# EAGLE design BIRDS-5_FM_+Z Panel_Ver2 (EAGLE 9.6.2)
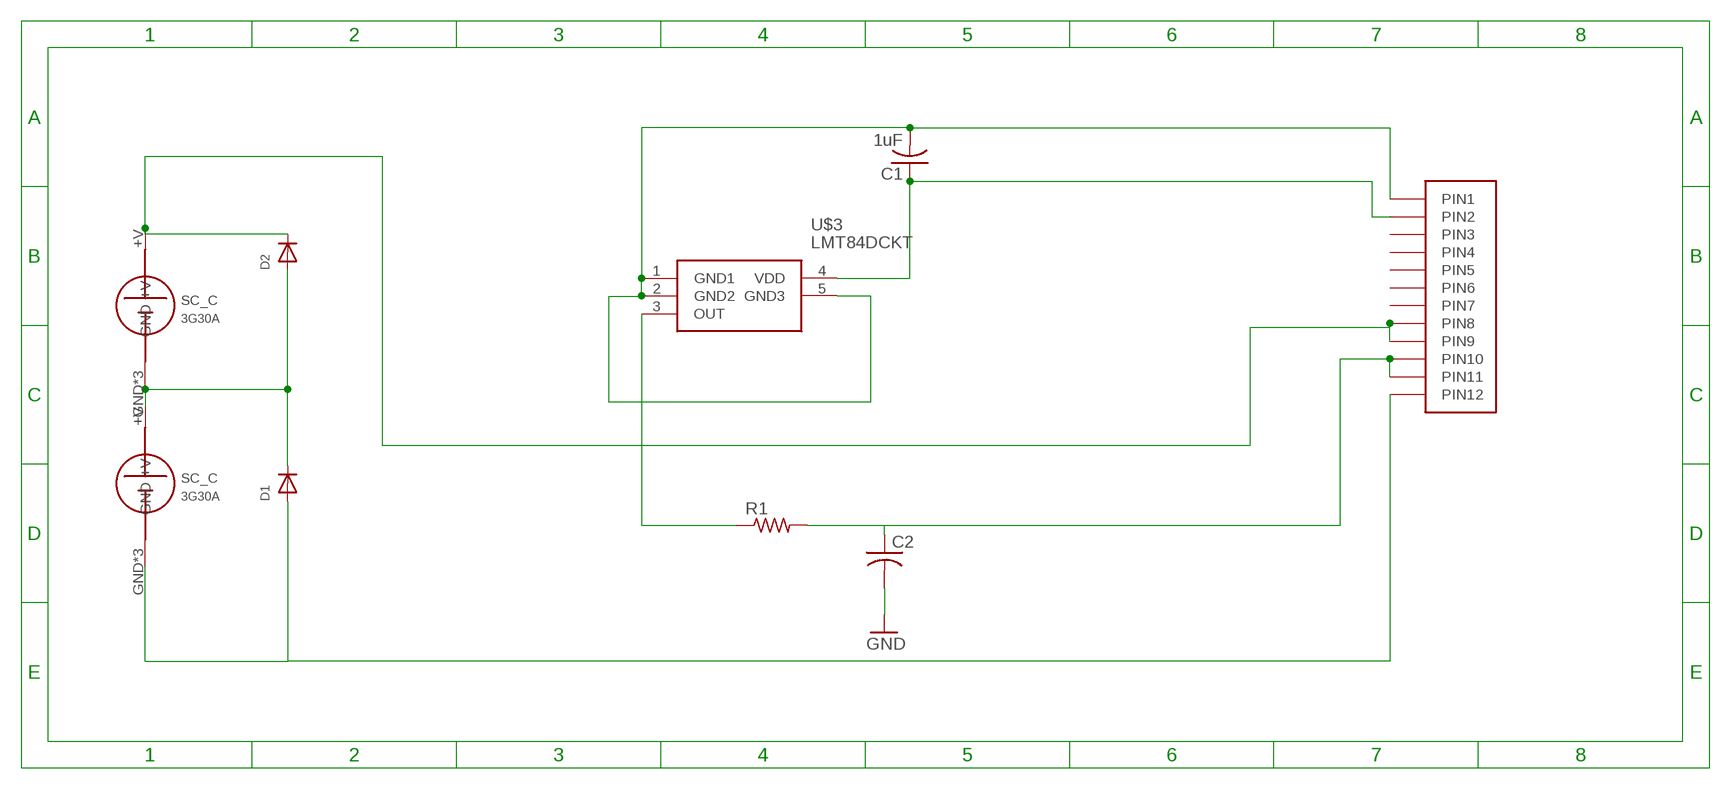
[diagram p0: schematic, sheet 1]

## Parts
C1  1uF  C-USC2012  [C2012]
C2  C-USC2012  [C2012]
D1  DIODE_SOD-123FL  [SOD-123FL]
D2  DIODE_SOD-123FL  [SOD-123FL]
R1  R-US_R0402  [R0402]
U$1  HEADER12PIN  [HEADER12PIN]
U$3  LMT84DCKT  [SOT65P210X110-5N]
U$4  SC_C  [SC_C]
U$5  SC_C  [SC_C]

## Nets
+V: D2.C U$1.P8(PIN8) U$1.P9(PIN9) U$4.+V
+VB: D1.C D2.A U$4.GND U$4.GND1(GND) U$4.GND2(GND) U$5.+V
GND: C1.2 C2.2 D1.A U$1.P1(PIN1) U$1.P12(PIN12) U$3.1(GND1) U$3.2(GND2) U$3.5(GND3) U$5.GND U$5.GND1(GND) U$5.GND2(GND)
N$3: C1.1 U$1.P2(PIN2) U$3.4(VDD)
N$5: R1.1 U$3.3(OUT)
N$6: C2.1 R1.2 U$1.P10(PIN10) U$1.P11(PIN11)
Unconnected: U$1.P3(PIN3) U$1.P4(PIN4) U$1.P5(PIN5) U$1.P6(PIN6) U$1.P7(PIN7)

## Library data of the parts
C1 C2 = adafruit:C-US: CAPACITOR, American symbol
D1 D2 = adafruit:DIODE: Diode SMADIODE - SMA Surface Mount Package 20V 1A Schottky Diode Digikey: 641-1014-6-ND DO-1N4148 - Through Hole Small Current Diode SOD-123 20V 1 A (.5mV Vf) Schottky Diode - Digikey: MBRX120TPMSCT-ND SOD-323 10V 570mA (.38mV Vf, 3ns) Schottky Diode - Digikey: ZLLS410CT-ND SOD-523 30V 30mA Schottky Diode (RB751S-40TE61) - Digikey: RB751S-40TE61CT-ND SOT23-R/W - SOT23 Package (R = Solder Paste/Reflow Ovens, W = Hand-Soldering) BAT54Film 40V 300mA - Digikey: 497-7162-1-ND
R1 = adafruit:R-US_: RESISTOR, American symbol
U$1 = BIRDS:HEADER12PIN
U$3 = LMT84DCKT:LMT84DCKT: 1.5V-Capable, 10 uA Analog Output Temperature Sensor in SC70 and TO-92 Source: Datasheet <http://uk.rs-online.com/web/p/products/8115860>; DESCRIPTION: 1.5V-Capable, 10 uA Analog Output Temperature Sensor in SC70 and TO-92; HEIGHT: 1.1mm; MANUFACTURER_NAME: Texas Instruments; MANUFACTURER_PART_NUMBER: LMT84DCKT; RS_PART_NUMBER: 8115860
U$4 U$5 = SC_C:SC_C

## Board
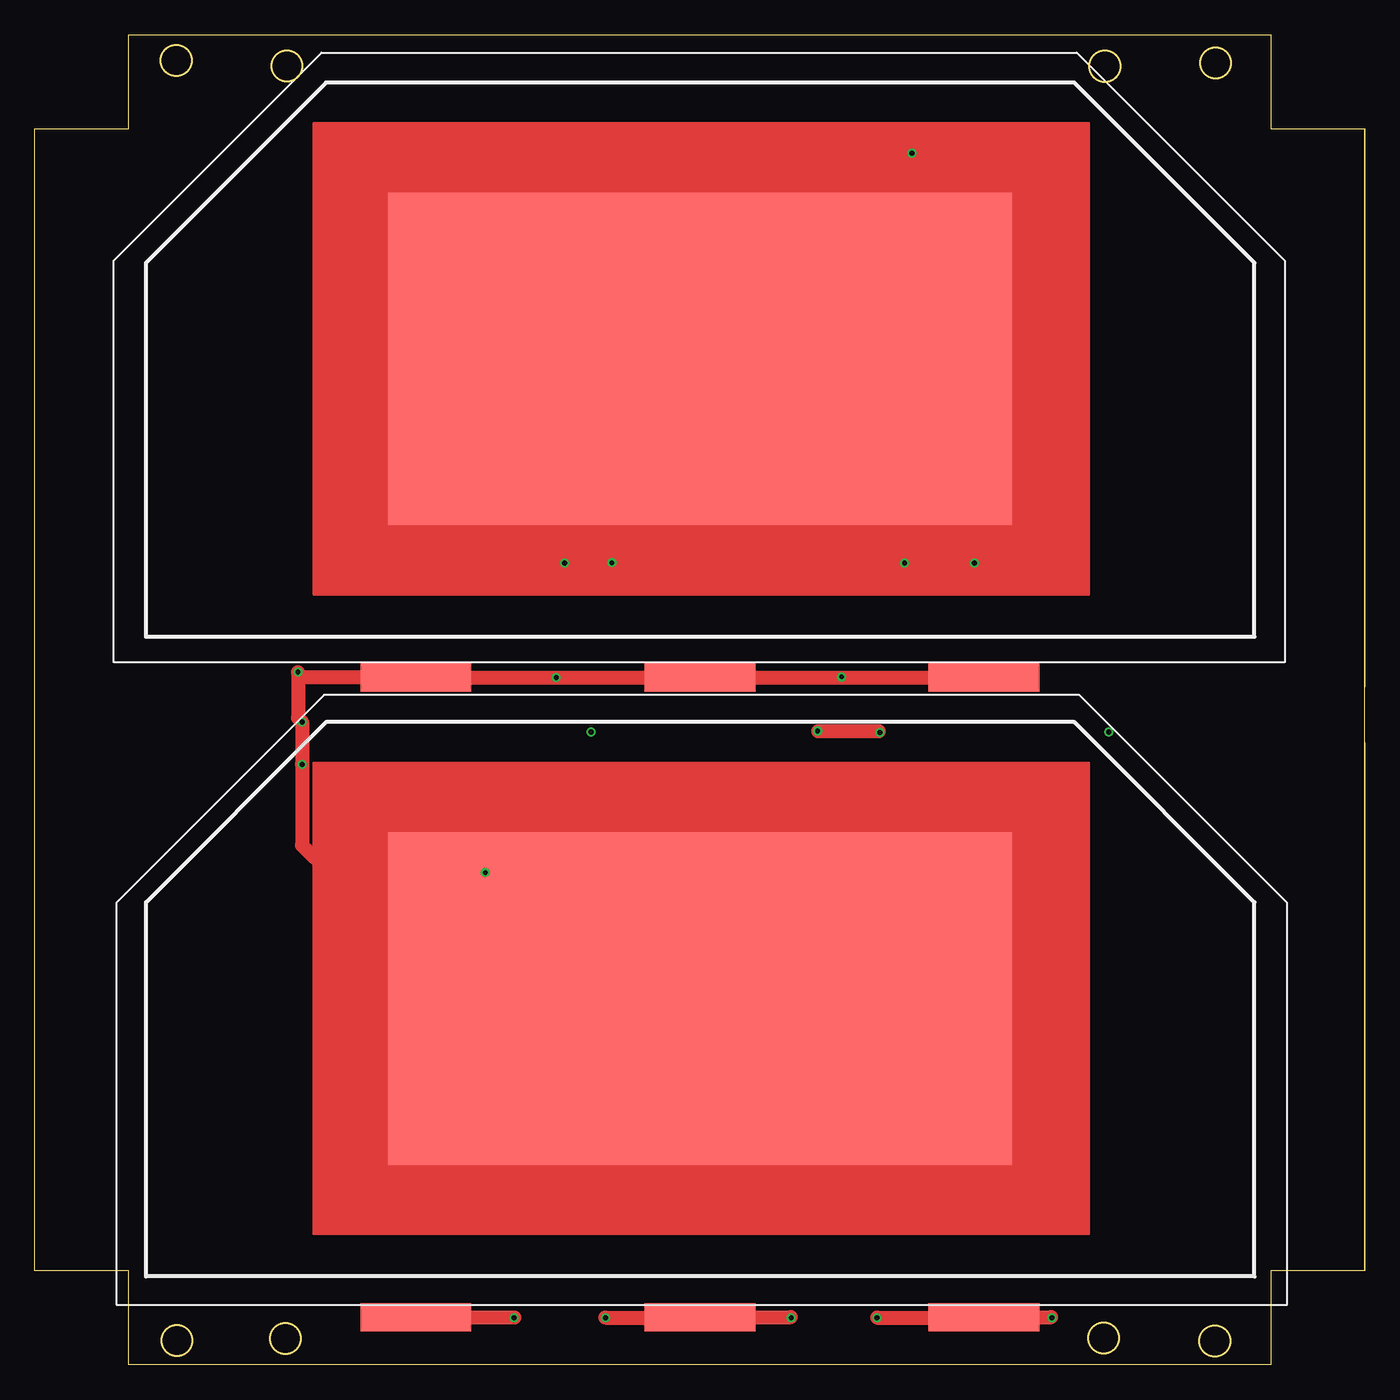
[diagram p1: board, top side]
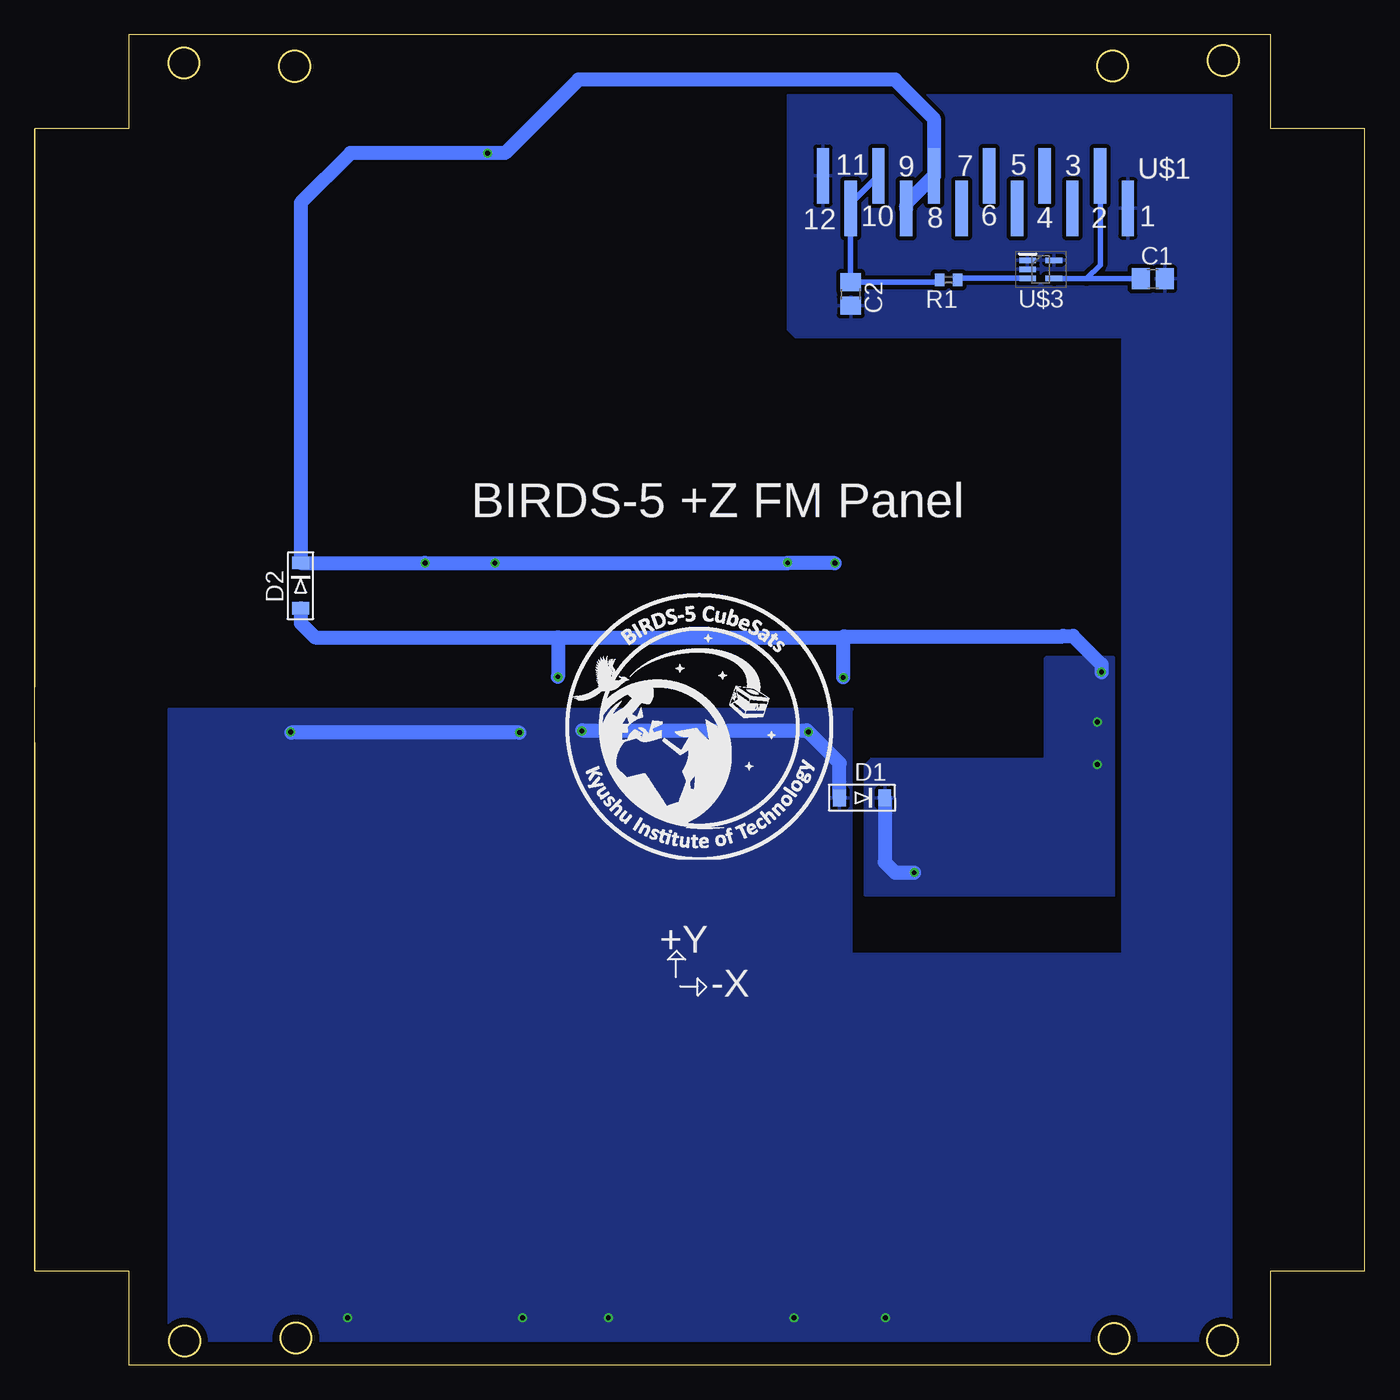
[diagram p2: board, bottom side, seen from below]

Size 96 x 96 mm. Coordinates in mm from the lower left corner, seen from the top.
Outline: 96,6.8 96,89.2
Outline: 96,89.2 96,48.91
Outline: 96,89.2 89.2,89.2 89.2,96 6.8,96 6.8,89.2 0,89.2 0,48.91 0,44.91 0,6.8 6.8,6.8 6.8,0 89.2,0 89.2,6.8 96,6.8
Outline: 96,44.91 96,6.8
Outline: circle at 77.23,93.72 radius 1.1
Outline: circle at 77.14,1.94 radius 1.1
Outline: circle at 18.22,93.75 radius 1.1
Outline: circle at 18.09,1.9 radius 1.1
Outline: circle at 10.26,1.74 radius 1.1
Outline: circle at 10.21,94.13 radius 1.1
Outline: circle at 85.22,93.96 radius 1.1
Outline: circle at 85.17,1.71 radius 1.1
Copper layers (1*16): Top 0.035mm / dielectric 1.53mm / Bottom 0.035mm
Design rules "pban_5mil-l2 *": minimum track width 5mil, minimum drill 0.3mm, track to track 5mil, track to pad 0.229mm, pad to pad 5mil, via to via 5mil, smd to smd 5mil, copper to edge 0.5mm, drill to drill 0.5mm, minimum pad ring 0.15mm, minimum via ring 0.15mm, stop-mask expansion 0.05mm, vias tented up to drill 0.35mm, thermal gap 10mil

### Footprints (pad centres in the part's own frame; a part is rotated, then mirrored left to right if it is on the bottom)
C2012 = smd 1.3 x 1.5: 1 -0.85,0; 2 0.85,0
SOD-123FL = smd 0.91 x 1.22 bottom: A 1.637,0; C -1.637,0
R0402 = smd 0.7 x 0.9: 1 -0.65,0; 2 0.65,0
HEADER12PIN = smd 4 x 0.89: P1 0,0; P2 2.35,2; P3 0,4; P4 2.35,6; P5 0,8; P6 2.35,10; P7 0,12; P8 2.35,14; P9 0,16; P10 2.35,18; P11 0,20; P12 2.35,22
SOT65P210X110-5N = smd 1.2 x 0.4: 1 -0.95,0.65; 2 -0.95,0; 3 -0.95,-0.65; 4 0.95,-0.65; 5 0.95,0.65
SC_C = smd 45 x 24: +V 39.89,20.06 | smd 8 x 2: GND 39.89,-2.94; GND1 60.39,-2.94; GND2 19.39,-2.94

### Placement (x,y rotation side)
C1  15.3,78.38 0 bottom
C2  37.1,77.28 270 bottom
D1  36.28,40.92 0 top
D2  76.8,56.24 270 top
R1  30.03,78.31 180 bottom
U$1  17.11,83.46 90 bottom
U$3  23.39,79.06 0 bottom
U$4  8.12,52.54 0 top
U$5  8.12,6.38 0 top

### Tracks (layer width: path | path; a pad name or v marks a point on that pad's centre or on a via)
+V  (via drill 0.35)
  Top 1.016: v41.66,57.89 48.02,64.25 U$4.+V
  Bottom 0.152: 67.83,57.88 v67.82,57.86
  Bottom 1: D2.C 67.83,57.88 | v67.82,57.86 v62.79,57.86 41.68,57.86 | v38.25,57.86 41.68,57.86 | v41.66,57.89 41.68,57.86
  Bottom 1.016: U$1.P9 33.02,83.89 U$1.P8 31.11,89.95 33.91,92.75 56.75,92.75 62.05,87.45 v63.32,87.45 73.2,87.45 76.8,83.86 D2.C
+VB  (via drill 0.35)
  Top 0.152: 19,46.71 v19.3,46.41 | 19.4,49.6 v19,50
  Top 1.016: U$4.GND1 U$4.GND U$4.GND2 19.4,49.6 | v19.3,46.41 v19.3,43.33 19.3,37.5 21.28,35.52 v32.52,35.52 41.61,26.44 U$5.+V | v19,50 19,46.71
  Bottom 0.152: 75.84,52.58 75.77,52.5 | 37.64,52.5 37.57,52.58 | 21.79,52.58 21.77,52.6 | 34.06,35.69 33.9,35.52
  Bottom 1.016: D2.A 76.8,53.53 75.84,52.58 | 75.77,52.5 58.24,52.5 | 58.24,52.5 37.64,52.5 v37.64,49.61 | 58.24,52.5 v58.24,49.66 | 37.57,52.58 21.79,52.58 | 21.77,52.6 21.06,52.6 19,50.55 v19,50 | D1.C 34.64,36.27 34.06,35.69 | 33.9,35.52 v32.52,35.52
  pour Bottom: 18.11,51.08 18.11,33.83 36.02,33.83 36.07,33.88 36.07,43.31 35.61,43.76 23.09,43.76 23.09,51 22.99,51.1 18.14,51.1
GND  (via drill 0.35)
  Top 0.152: v56.51,45.75 56.54,45.72 | 60.92,45.72 v61.01,45.63 | 47.98,3.4 U$5.GND | 54.56,3.44 v54.6,3.4 | 68.47,3.4 U$5.GND1 | 73.36,3.44 v73.4,3.4
  Top 1.016: v34.6,3.4 28.72,3.4 27.56,3.45 U$5.GND2 | 60.92,45.72 56.54,45.72 | v41.2,3.4 47.98,3.4 | U$5.GND 54.56,3.44 | v60.8,3.4 68.47,3.4 | U$5.GND1 73.36,3.44
  Bottom 0.152: 56.47,45.79 v56.51,45.75 | 77.48,45.63 v77.53,45.68
  Bottom 1.016: D1.A 37.92,43.42 v40.16,45.66 40.29,45.79 56.47,45.79 | v61.01,45.63 77.48,45.63
  pour Bottom (isolate 0.305): 9.6,91.62 41.68,91.62 41.68,74.73 41.12,74.17 17.53,74.17 17.53,29.64 37.01,29.64 37.01,47.24 36.93,47.32 86.36,47.32 86.36,1.85 86.49,1.73 9.63,1.73 9.6,1.75
N$3
  Bottom 0.152: 22.41,78.38 U$3.4
  Bottom 0.406: C1.1 20.1,78.38 | 20.1,78.38 22.41,78.38 | U$1.P2 19.1,79.37 20.1,78.38
N$5
  Bottom 0.152: 29.28,78.41 R1.1
  Bottom 0.406: U$3.3 29.28,78.41
N$6
  Bottom 0.152: U$1.P11 37.13,83.68
  Bottom 0.406: 37.13,78.13 37.12,78.13 C2.1 | 37.13,78.13 30.88,78.13 30.7,78.31 R1.2 | U$1.P10 35.1,85.83 36.81,84.12 37.01,84.12 U$1.P11 | 37.13,83.68 37.13,78.13

### Text on the board
bPlace: +Y | -X
bNames: U$1 | 3 | 5 | 7 | 9 | 11 | 1 | 2 | 4 | 6 | 8 | 10 | 12 | BIRDS-5 +Z FM Panel